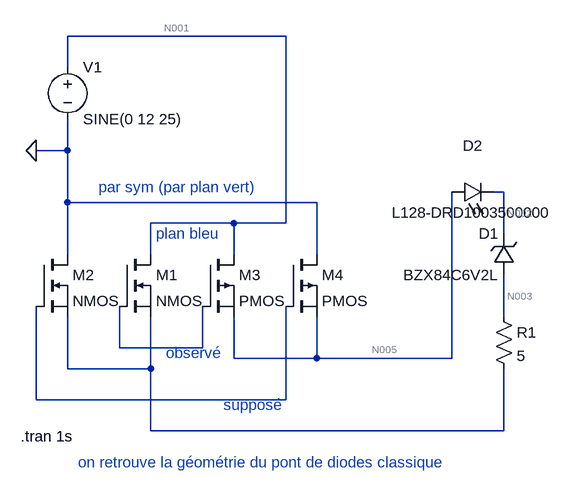
[diagram p0: schematic reelight.asc]
reelight.asc, the LTspice schematic file:
Version 4
SHEET 1 1276 680
WIRE 432 -224 96 -224
WIRE 96 -176 96 -224
WIRE 96 -48 96 -96
WIRE 96 -48 48 -48
WIRE 768 16 752 16
WIRE 96 32 96 -48
WIRE 480 32 96 32
WIRE 352 64 224 64
WIRE 432 64 432 -224
WIRE 432 64 352 64
WIRE 768 80 768 16
WIRE 96 112 96 32
WIRE 224 112 224 64
WIRE 352 112 352 64
WIRE 480 112 480 32
WIRE 768 208 768 144
WIRE 176 256 176 192
WIRE 304 256 304 192
WIRE 304 256 176 256
WIRE 352 272 352 208
WIRE 480 272 480 208
WIRE 480 272 352 272
WIRE 688 272 688 16
WIRE 688 272 480 272
WIRE 96 288 96 208
WIRE 224 288 224 208
WIRE 224 288 96 288
WIRE 48 336 48 192
WIRE 432 336 432 192
WIRE 432 336 48 336
WIRE 224 384 224 288
WIRE 768 384 768 288
WIRE 768 384 224 384
FLAG 48 -48 0
SYMBOL nmos 176 112 R0
SYMATTR InstName M1
SYMBOL nmos 48 112 R0
SYMATTR InstName M2
SYMBOL pmos 304 112 R0
SYMATTR InstName M3
SYMBOL pmos 432 112 R0
SYMATTR InstName M4
SYMBOL voltage 96 -192 R0
WINDOW 123 0 0 Left 0
WINDOW 39 0 0 Left 0
SYMATTR InstName V1
SYMATTR Value SINE(0 12 25)
SYMBOL zener 784 144 R180
WINDOW 0 24 64 Left 2
WINDOW 3 24 0 Left 2
SYMATTR InstName D1
SYMATTR Value BZX84C6V2L
SYMBOL LED 688 32 R270
WINDOW 0 72 32 VTop 2
WINDOW 3 0 32 VBottom 2
SYMATTR InstName D2
SYMATTR Value L128-DRD1003500000
SYMATTR Description Diode
SYMATTR Type diode
SYMBOL res 752 192 R0
SYMATTR InstName R1
SYMATTR Value 5
TEXT 144 8 Left 2 ;par sym (par plan vert)
TEXT 232 80 Left 2 ;plan bleu
TEXT 24 392 Left 2 !.tran 1s
TEXT 248 264 Left 2 ;observé
TEXT 336 344 Left 2 ;supposé
TEXT 112 432 Left 2 ;on retrouve la géométrie du pont de diodes classique

The netlist it stands for:
* reelight.asc
M1 N001 N004 N006 N006 NMOS
M2 0 N007 N006 N006 NMOS
M3 N001 N004 N005 N005 PMOS
M4 0 N007 N005 N005 PMOS
V1 N001 0 SINE(0 12 25)
D1 N003 N002 BZX84C6V2L
D2 N005 N002 L128-DRD1003500000
R1 N003 N006 5
.model D D
.lib standard.dio
.model NMOS NMOS
.model PMOS PMOS
.lib standard.mos
* par sym (par plan vert)
* plan bleu
.tran 1s
* observé
* supposé
* on retrouve la géométrie du pont de diodes classique
.backanno
.end

* Results of the author's LTspice run, read from the files saved beside the schematic
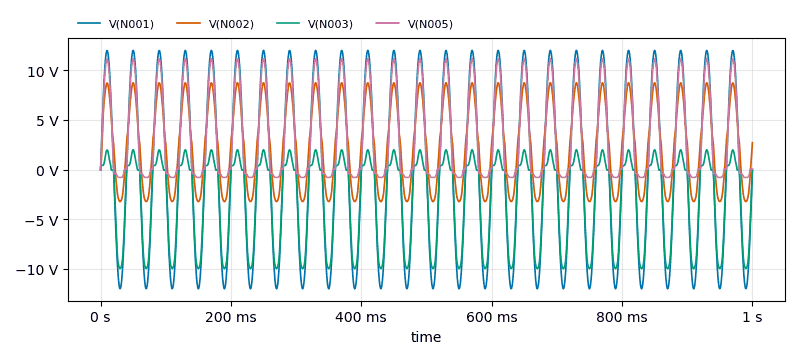
[diagram p1: Transient Analysis of reelight.asc, plotted from the saved traces]
* Transient Analysis, 1 run:
*   V(N001): min -12 V, max 12 V, average 11.97 µV, rms 8.481 V, last 0 V
*   V(N002): min -3.226 V, max 8.745 V, average 2.403 V, rms 4.823 V, last 2.704 V
*   V(N003): min -9.972 V, max 1.999 V, average -2.921 V, rms 5.27 V, last -46.02 mV
*   V(N005): min -797 mV, max 11.17 V, average 3.235 V, rms 5.53 V, last 38.97 mV